# Altium schematic sheet 02 Mobile Power.SchDoc: ECE453 PWR
size B; Author: JSK; Revision: A; SheetNumber: 2; SheetTotal: 2; AssemblyNumber: ECE453-01; CurrentDate: 1/09/2018
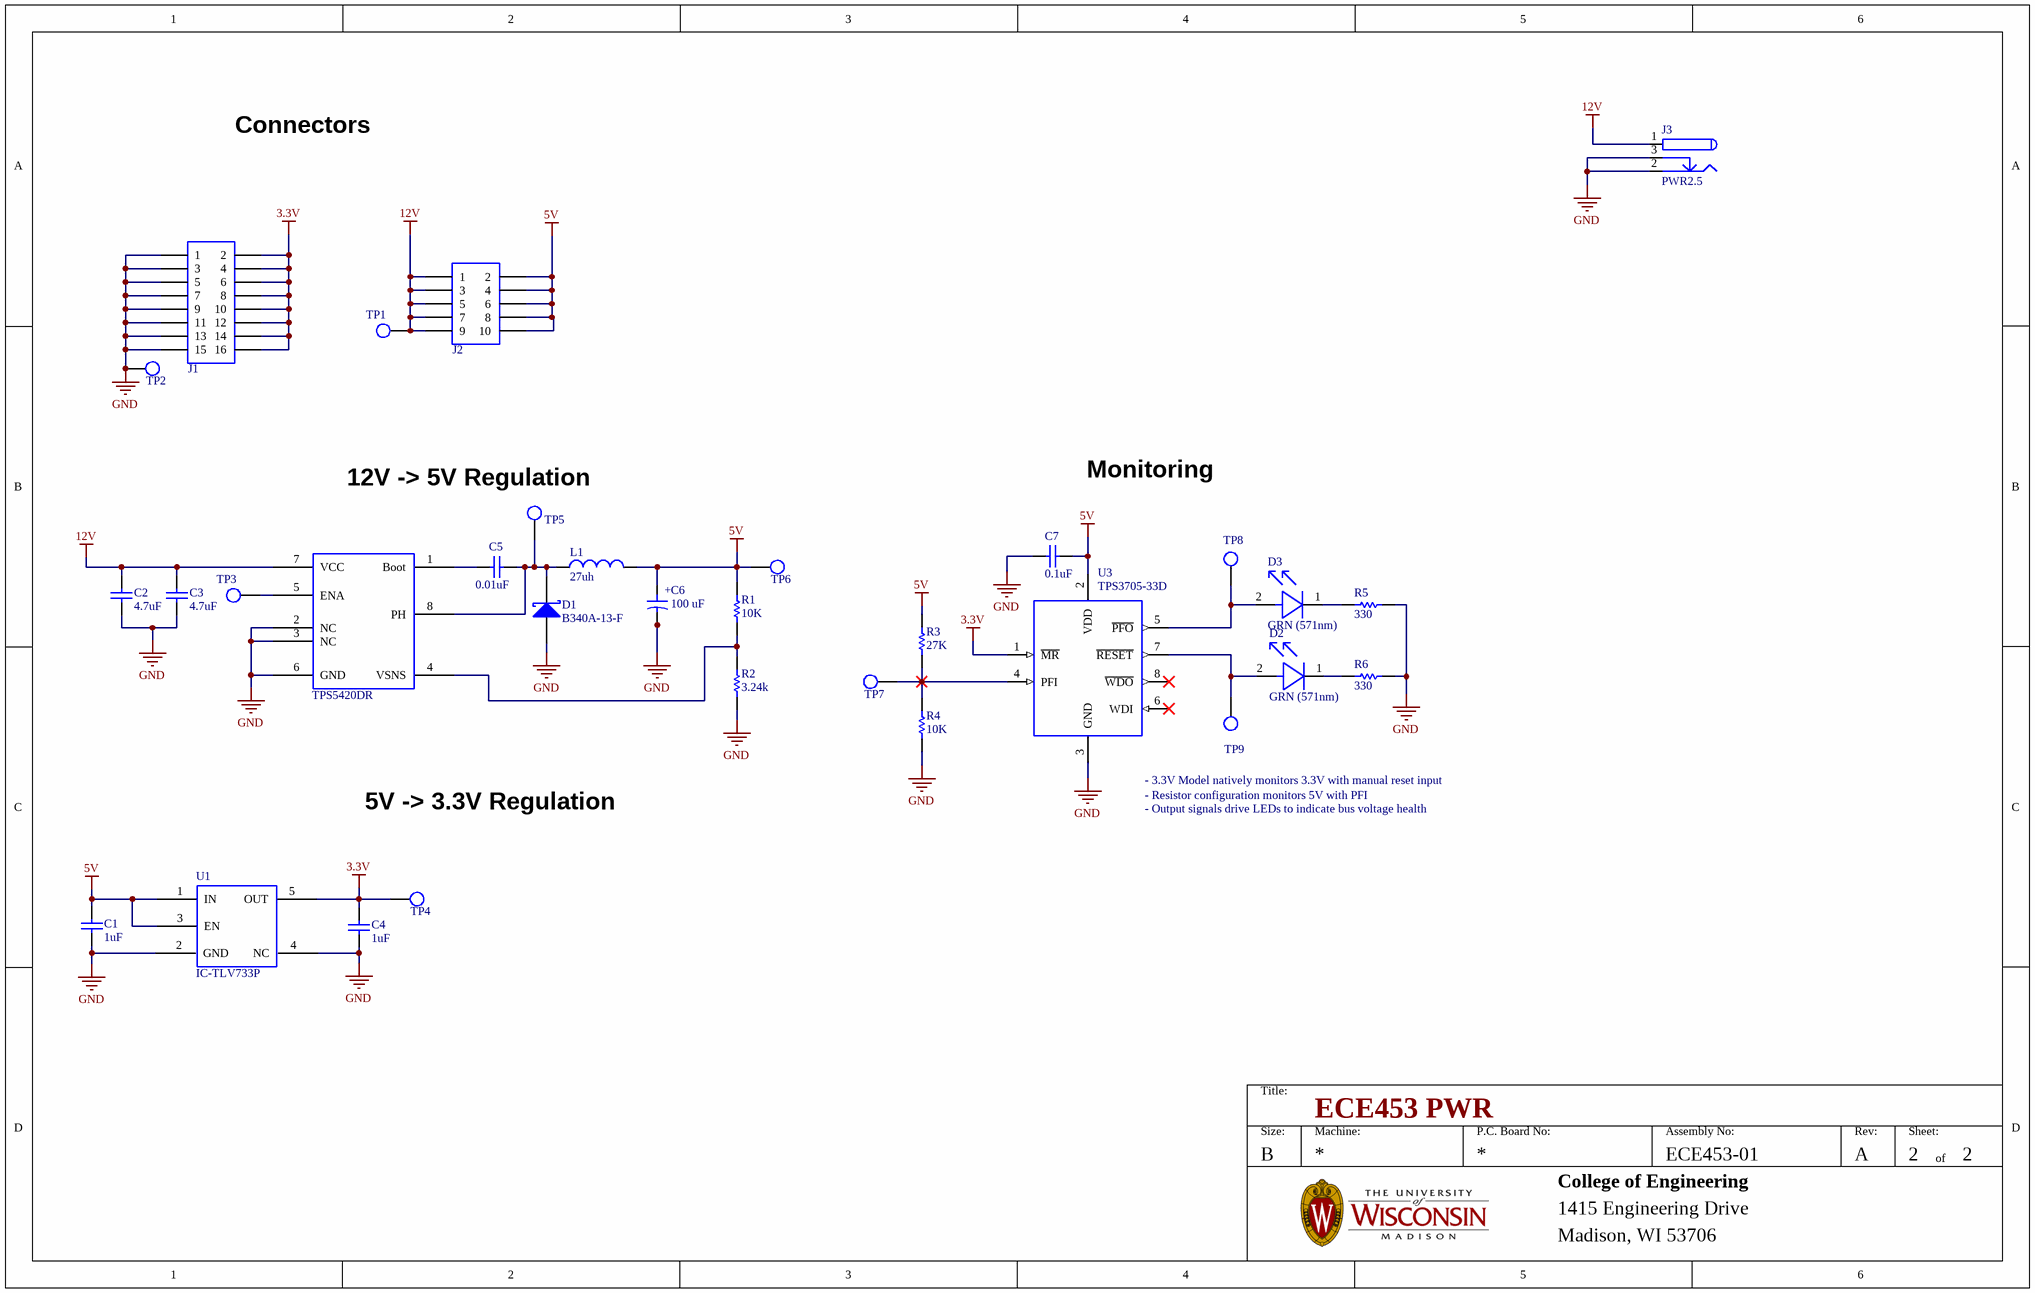
[diagram p0: 02 Mobile Power.SchDoc]

## Parts
C1  1uF  [CAP_0805]
C2  4.7uF  [CAP_0805]
C3  4.7uF  [CAP_0805]
C4  1uF  [CAP_0805]
C5  0.01uF  [CAP_0805]
C6  100 uF  [CAP_100uF]
C7  0.1uF  [CAP_0805]
D1  Manufacturer Part Number: B340A-13-F  [B340A]  (hidden comment: DIODE_B340A)
D2  value GRN (571nm)  [DIODE_0805]  (hidden comment: LED_GREEN_0805.1)
D3  value GRN (571nm)  [DIODE_0805]  (hidden comment: LED_GREEN_0805.1)
J1  CONN_HEADER_MALE_8x2  [SBH11-PBPC-D08-ST-BK]  (value not drawn)
J2  CONN_HEADER_MALE_5x2  [SBH11-PBPC-D05-ST-BK]  (value not drawn)
J3  PWR2.5  [PJ-102]
L1  Inductance: 27uh  [IND-ASPI-8040S]  (hidden comment: IND_8040S_270M)
R1  10K  [RES_0805]
R2  Resistance: 3.24k  [RES_0805]  (hidden comment: RES_0805_K_003.34)
R3  27K  [RES_0805]
R4  10K  [RES_0805]
R5  330  [RES_0805]
R6  330  [RES_0805]
TP1  TP_1206  [TP-SMC-1206]  (value not drawn)
TP2  TP_1206  [TP-SMC-1206]  (value not drawn)
TP3  TP_1206  [TP-SMC-1206]  (value not drawn)
TP4  TP_1206  [TP-SMC-1206]  (value not drawn)
TP5  TP_1206  [TP-SMC-1206]  (value not drawn)
TP6  TP_1206  [TP-SMC-1206]  (value not drawn)
TP7  TP_1206  [TP-SMC-1206]  (value not drawn)
TP8  TP_1206  [TP-SMC-1206]  (value not drawn)
TP9  TP_1206  [TP-SMC-1206]  (value not drawn)
U1  IC-TLV733P  [TI-SOT-23-5]
U2  Manufacturer Part Number: TPS5420DR  [TI-SOIC-8]  (hidden comment: IC_TPS5420)
U3  Manufacturer Part Number: TPS3705-33D  [TI-SOIC-8]  (hidden comment: IC_TPS3705-33DGN.1)

## Nets
3.3V: C4.2 J1.2 J1.4 J1.6 J1.8 J1.10 J1.12 J1.14 J1.16 TP4.1 U1.5(OUT) U3.1(~{MR})
5V: C1.2 C6.1 C7.2 J2.2 J2.4 J2.6 J2.8 J2.10 L1.2 R1.2 R3.2 TP6.1 U1.1(IN) U1.3(EN) U3.2(VDD)
12V: C2.2 C3.2 J2.1 J2.3 J2.5 J2.7 J2.9 J3.1 TP1.1 U2.7(VCC)
GND: C1.1 C2.1 C3.1 C4.1 C6.2 C7.1 D1.1(A) J1.1 J1.3 J1.5 J1.7 J1.9 J1.11 J1.13 J1.15 J3.2 J3.3 R2.1 R4.1 R5.2 R6.2 TP2.1 U1.2(GND) U1.4(NC) U2.2(NC) U2.3(NC) U2.6(GND) U3.3(GND)
NetC5_1: C5.1 U2.1(Boot)
NetC5_2: C5.2 D1.2(K) L1.1 TP5.1 U2.8(PH)
NetD2_1: D2.1(Cathode) R6.1
NetD2_2: D2.2(Anode) TP9.1 U3.7(~{RESET})
NetD3_1: D3.1(Cathode) R5.1
NetD3_2: D3.2(Anode) TP8.1 U3.5(~{PFO})
NetR1_1: R1.1 R2.2 U2.4(VSNS)
NetR3_1: R3.1 R4.2 TP7.1 U3.4(PFI)
NetTP3_1: TP3.1 U2.5(ENA)

Not connected (* = marked no-connect by the designer): U3 6(WDI)* 8(~{WDO})*

## Notes on the sheet
- Connectors
- 12V -> 5V Regulation
- Monitoring
- 5V -> 3.3V Regulation
- - 3.3V Model natively monitors 3.3V with manual reset input
- - Resistor configuration monitors 5V with PFI
- - Output signals drive LEDs to indicate bus voltage health
- Title:
- Size:
- B
- Machine:
- P.C. Board No:
- Assembly No:
- Rev:
- Sheet:
- of
- College of Engineering
- 1415 Engineering Drive
- Madison, WI 53706
- (in symbol CAP_100uF) +

## Library data of the parts
C1 C4 = CAP_0805_U_001.00: CAP CER 1 UF 6.3V 10% X5R 0805; Tolerance: +/-10%; Value: 10UF; Package: 0805; Rating: 6.3V; Supplier 1: Digi-Key; Supplier Part Number 1: 399-9160-1-ND
C2 C3 = CAP_0805_U_004.70: CAP CER 4.7 UF 16V 10% X5R 0805; Tolerance: +/-10%; Package: 0805; Rating: 16V; Value: 4.7UF; Supplier 1: Digi-Key; Supplier Part Number 1: 478-5166-6-ND
C5 = CAP_0805_U_000.01: CAP CER 10000PF 16V 10% X7R 0805; Tolerance: +/-10%; Package: 0805; Rating: 16V; Supplier 1: Digi-Key; Supplier Part Number 1: 399-7995-1-ND; Value: 10000PF
C6 = CAP_100uF: Manufacturer: Nichicon; Manufacturer Part Number: UCD1V101MNL1GS; Capacitance: 100µF; Tolerance: ±20%; Voltage Rating: 35V; Lifetime @ Temp.: 5000 Hrs @ 105°C; Ripple Current: 600mA; Impedance: 160 mOhm; Surface Mount Land Size: 0.327" L x 0.327" W (8.30mm x 8.30mm); Supplier 1: Digi-Key; RoHS: RoHS Compliant; Category: Capacitors; Stock 1: 2915; Pricing 1: 1=0.57, 10=0.548, 25=0.3884, 50=0.3272, 100=0.2659, 250=0.22088 (USD); Packaging: Cut Tape (CT); ESR (Equivalent Series Resistance): -; Operating Temperature: -55°C ~ 105°C; Type: -; Applications: General Purpose; Lead Spacing: -; Size / Dimension: 0.315" Dia (8.00mm); Height - Seated (Max): 0.413" (10.50mm); Mounting Type: Surface Mount; Package / Case: Radial, Can - SMD; ComponentLink1URL: http://nichicon-us.com/english/products/pdfs/e-cd.pdf; ComponentLink1Description: http://nichicon-us.com/english/products/pdfs/e-cd.pdf; Supplier Part Number 1: 493-6186-1-ND
C7 = CAP_0805_U_000.10: CAP CER 0.1 UF 6.3V 10% X7R 0805; Tolerance: +/-10%; Value: 1UF; Package: 0805; Rating: 6.3V; Supplier 1: Digi-Key; Supplier Part Number 1: 399-9155-6-ND
D1 = DIODE_B340A: DIODE SCHOTTKY 40V 3A SMA; Manufacturer: Diodes; Element Configuration: Single; Peak Reverse Current: 500uA; Forward Voltage: 500mV; Max Forward Surge Current (Ifsm): 80A; Polarity: Standard; Capacitance: 250pF; ComponentLink1URL: http://www.mccsemi.com/up_pdf/MBRX120-MBRX160(SOD123).pdf; ComponentLink1Description: http://www.mccsemi.com/up_pdf/MBRX120-MBRX160(SOD123).pdf; Supplier 1: Digi-Key; Stock 1: 590182; Pricing 1: 1=0.46, 10=0.373, 100=0.2538, 500=0.19034, 1000=0.14276 (USD); Mount: Surface Mount; Case/Package: SMA; Number of Pins: 2; Weight: 0.002258oz; Contact Plating: Tin,Matte; Min Operating Temperature: -55°C; Max Operating Temperature: 125°C; Forward Current: 3A; Max Repetitive Reverse Voltage (Vrrm): 40V; Packaging: Tape and Reel; Peak Non-Repetitive Surge Current: 80A; Package Quantity: 5000; Average Rectified Current: 3A; Termination: SMD/SMT; Voltage Rating (DC): 40V; Current Rating: 3A; Output Current: 3A; Current: 3A; Voltage: 40V; Max Reverse Voltage (DC): 40V; Length: 4.6mm; Height: 2.3mm; Width: 2.92mm; Radiation Hardening: No; REACH SVHC: No SVHC; Lead Free: Lead Free; ComponentLink2URL: https://datasheet.ciiva.com/4245/861ds30891-4245763.pdf; ComponentLink2Description: https://datasheet.ciiva.com/4245/861ds30891-4245763.pdf; ComponentLink3URL: https://datasheet.ciiva.com/1177/ds30891-1177476.pdf; ComponentLink3Description: https://datasheet.ciiva.com/1177/ds30891-1177476.pdf; ComponentLink4URL: https://datasheet.ciiva.com/1240/ds30891-1240228.pdf; ComponentLink4Description: https://datasheet.ciiva.com/1240/ds30891-1240228.pdf; ComponentLink5URL: https://datasheet.ciiva.com/913/ds30891-913637.pdf; ComponentLink5Description: https://datasheet.ciiva.com/913/ds30891-913637.pdf; ComponentLink6URL: https://datasheet.ciiva.com/913/ds30891-913638.pdf; ComponentLink6Description: https://datasheet.ciiva.com/913/ds30891-913638.pdf; ComponentLink7URL: https://datasheet.ciiva.com/913/ds30891-913639.pdf; ComponentLink7Description: https://datasheet.ciiva.com/913/ds30891-913639.pdf; ComponentLink8URL: https://datasheet.ciiva.com/26949/getdatasheetpartid-143394-26949352.pdf; ComponentLink8Description: https://datasheet.ciiva.com/26949/getdatasheetpartid-143394-26949352.pdf; ComponentLink9URL: https://datasheet.ciiva.com/46393/1911813-46393773.pdf; ComponentLink9Description: https://datasheet.ciiva.com/46393/1911813-46393773.pdf; Supplier Part Number 1: B340A-FDICT-ND
D2 D3 = LED_GREEN_0805.1: LED GREEN CLEAR THIN 0805 SMD; Rating: 20mA; Package: 0805; Tolerance: N/A; Supplier 1: Digi-Key; Supplier Part Number 1: 160-1426-1-ND
J1 = CONN_HEADER_MALE_8x2: CONN HEADER 2.54MM 16POS GOLD; Manufacturer: Sullins Connector Solutions; Pitch: 0.100" (2.54mm); Number of Positions Loaded: All; Number of Positions: 16; Connector Type: Header, Shrouded; Contact Finish Thickness: Flash; Contact Mating Length: -; Fastening Type: -; Contact Finish: Gold; Packaging: Tray; Row Spacing: 0.100" (2.54mm); RoHS: RoHS Compliant; Contact Type: Male Pin; Category: Connectors, Interconnects; Part Status: Active; Features: Polarizing Key; Color: Black; Mounting Type: Through Hole; Termination: Solder; Manufacturer Part Number: SBH11-PBPC-D08-ST-BK; Number of Rows: 2; Supplier 1: Digi-Key; Stock 1: 13784; Pricing 1: 1=0.55, 10=0.428, 25=0.3988, 50=0.3626, 100=0.3263, 250=0.27552, 500=0.261, 1000=0.232, 2500=0.19285 (USD); ComponentLink1URL: http://sullinscorp.com/catalogs/145_PAGE118_.100_SBH11_SERIES_MALE_BOX_HDR_ST_RA_SMT.pdf; ComponentLink1Description: http://sullinscorp.com/catalogs/145_PAGE118_.100_SBH11_SERIES_MALE_BOX_HDR_ST_RA_SMT.pdf; Supplier Part Number 1: S9171-ND
J2 = CONN_HEADER_MALE_5x2: CONN HEADER 2.54MM 10POS GOLD; Manufacturer: Sullins Connector Solutions; Pitch: 0.100" (2.54mm); Number of Positions: 10; Number of Positions Loaded: All; Connector Type: Header, Shrouded; Contact Mating Length: -; Fastening Type: -; Termination: Solder; Mounting Type: Through Hole; Color: Black; Contact Finish Thickness: Flash; Row Spacing: 0.100" (2.54mm); Contact Finish: Gold; Number of Rows: 2; Features: Polarizing Key; Contact Type: Male Pin; Manufacturer Part Number: SBH11-PBPC-D05-ST-BK; Category: Connectors, Interconnects; Packaging: Tray; Part Status: Active; RoHS: RoHS Compliant; Supplier 1: Digi-Key; Stock 1: 29227; Pricing 1: 1=0.64, 10=0.445, 25=0.3812, 50=0.343, 100=0.2985, 250=0.254, 500=0.2413, 1000=0.2159, 2500=0.17145 (USD); ComponentLink1URL: http://sullinscorp.com/catalogs/145_PAGE118_.100_SBH11_SERIES_MALE_BOX_HDR_ST_RA_SMT.pdf; ComponentLink1Description: http://sullinscorp.com/catalogs/145_PAGE118_.100_SBH11_SERIES_MALE_BOX_HDR_ST_RA_SMT.pdf; Supplier Part Number 1: S9169-ND
J3 = PWR2.5: Low Voltage Power Supply Connector; Manufacturer: CUI; Manufacturer Part Number: PJ-102A; Gender: Male; Shielding: Unshielded; Current Rating: 2.5A; Connector Type: Jack; Voltage Rating: 24V; Insulation Resistance: 50MR; Number of Conductors: 2; Published: 17-Dec-2003; DatasheetDocument: 09-May-2002; Publisher: Altium Limited; ComponentLink1Description: Manufacturer Link; ComponentLink1URL: http://domino.kycon.com/internet/Products.html; Supplier 1: Digi-Key; Stock 1: 20997; Pricing 1: 1=0.64, 10=0.6, 25=0.54, 50=0.48, 100=0.46, 250=0.42, 500=0.4, 1000=0.33, 2500=0.3 (USD); Mount: Through Hole; Colour: Black; Contact Material: Copper; Contact Plating: Nickel; Housing Colour: Black; Housing Material: Thermoplastic; Min Operating Temperature: -25°C; Max Operating Temperature: 85°C; Package Quantity: 280; Termination: Through Hole; Contact Gender: Male; Orientation: Horizontal; Packaging: Bulk; Diameter: 2.1mm; Lead Free: Lead Free; Flammability Rating: UL94 V-0; ComponentLink2URL: http://www.cui.com/Product/Resource/FuturePDF/PJ-102A.pdf; ComponentLink2Description: http://www.cui.com/Product/Resource/FuturePDF/PJ-102A.pdf; ComponentLink3URL: http://www.mouser.com/ds/2/670/PJ-102A-524195.pdf; ComponentLink3Description: http://www.mouser.com/ds/2/670/PJ-102A-524195.pdf; ComponentLink4URL: https://www.cui.com/product/resource/digikeypdf/pj-102a.pdf; ComponentLink4Description: https://www.cui.com/product/resource/digikeypdf/pj-102a.pdf; Supplier Part Number 1: CP-102A-ND
L1 = IND_8040S_270M: Manufacturer: Abracon; Manufacturer Part Number: ASPI-8040S-270M-T; Core Material: Ferrite; Tolerance: 20%; Current Rating: 2A; Shielding: Shielded; DC Resistance (DCR): 78mR; Test Frequency: 100kHz; Saturation Current: 2.15A; Self Resonant Frequency: 9.2MHz; ComponentLink1URL: http://www.abracon.com/Magnetics/chips/AIML-1206.pdf; ComponentLink1Description: http://www.abracon.com/Magnetics/chips/AIML-1206.pdf; Supplier 1: Digi-Key; Stock 1: 2115; Pricing 1: 1=0.97, 10=0.897, 100=0.6486, 500=0.4968 (USD); Mount: Surface Mount; Case/Package: Nonstandard; Min Operating Temperature: -40°C; Max Operating Temperature: 125°C; Packaging: Tape and Reel; Composition: Wirewound; Max DC Current: 2A; Package Quantity: 1000; Length: 0.315inch; Height: 4mm; Width: 0.315inch; Height - Seated (Max): 0.157inch; Lead Free: Lead Free; ComponentLink2URL: https://datasheet.ciiva.com/8518/aspi-8040s-8518746.pdf; ComponentLink2Description: https://datasheet.ciiva.com/8518/aspi-8040s-8518746.pdf; ComponentLink3URL: https://datasheet.ciiva.com/1080/aspi-8040s-1080475.pdf; ComponentLink3Description: https://datasheet.ciiva.com/1080/aspi-8040s-1080475.pdf; ComponentLink4URL: https://datasheet.ciiva.com/1080/aspi-8040s-1080476.pdf; ComponentLink4Description: https://datasheet.ciiva.com/1080/aspi-8040s-1080476.pdf; Supplier Part Number 1: ASPI-8040S-270M-TCT-ND
R1 R4 = RES_0805_K_010.00: RES SMD 10K OHM 1% 1/8W 0805; Manufacturer Part Number: ERJ-6ENF1002V; Manufacturer: Panasonic Electronic Components; Power (Watts): 0.125W, 1/8W; Temperature Coefficient: ±100ppm/°C; Part Status: Active; Supplier Device Package: 0805; Category: Resistors; Tolerance: ±1%; Package / Case: 0805 (2012 Metric); Number of Terminations: 2; RoHS: RoHS Compliant; Supplier: Digi-Key; Size / Dimension: 0.079" L x 0.049" W (2.00mm x 1.25mm); Failure Rate: -; Resistance (Ohms): 10k; Composition: Thick Film; Packaging: Cut Tape (CT); Features: Automotive AEC-Q200; Height - Seated (Max): 0.028" (0.70mm); Operating Temperature: -55°C ~ 155°C; Supplier Part Number: P10.0KCCT-ND
R2 = RES_0805_K_003.34: RES SMD 3.24K OHM 1% 1/8W 0805; Manufacturer: Panasonic; Manufacturer Part Number: ERJ-6ENF3241V; Power Rating: 125mW; Voltage Rating: 150V; Temperature Coefficient: 100ppm/°C; Supplier 1: Digi-Key; Stock 1: 232903; Pricing 1: 1=0.1, 10=0.079, 100=0.0305, 1000=0.0134, 2500=0.01157 (USD); Mount: Surface Mount; Case/Package: 0805; Case Code (Metric): 2012; Case Code (Imperial): 0805; Contact Plating: Tin; Min Operating Temperature: -55°C; Max Operating Temperature: 155°C; Tolerance: 1%; Packaging: Tape and Reel; Package Quantity: 1; Composition: Thick Film; Voltage Rating (DC): 150V; Termination: SMD/SMT; Military Standard: Not; Number of Terminations: 2; Max Power Dissipation: 125mW; Length: 2mm; Height: 0.6mm; Width: 0.049inch; Depth: 1.25mm; Radiation Hardening: No; REACH SVHC: No SVHC; Lead Free: Lead Free; ComponentLink1URL: https://datasheet.ciiva.com/9196/aoa0000ce2-9196535.pdf; ComponentLink1Description: https://datasheet.ciiva.com/9196/aoa0000ce2-9196535.pdf; ComponentLink2URL: https://datasheet.ciiva.com/30112/aoa0000ce2-30112759.pdf; ComponentLink2Description: https://datasheet.ciiva.com/30112/aoa0000ce2-30112759.pdf; ComponentLink3URL: https://datasheet.ciiva.com/28531/1694929-28531704.pdf; ComponentLink3Description: https://datasheet.ciiva.com/28531/1694929-28531704.pdf; ComponentLink4URL: https://datasheet.ciiva.com/46372/1678782-46372873.pdf; ComponentLink4Description: https://datasheet.ciiva.com/46372/1678782-46372873.pdf; ComponentLink5URL: https://datasheet.ciiva.com/17213/aoa0000ce2-17213770.pdf; ComponentLink5Description: https://datasheet.ciiva.com/17213/aoa0000ce2-17213770.pdf; ComponentLink6URL: https://datasheet.ciiva.com/46372/1678782-46372874.pdf; ComponentLink6Description: https://datasheet.ciiva.com/46372/1678782-46372874.pdf; ComponentLink7URL: https://datasheet.ciiva.com/24026/aoa0000ce2-24026155.pdf; ComponentLink7Description: https://datasheet.ciiva.com/24026/aoa0000ce2-24026155.pdf; ComponentLink8URL: https://datasheet.ciiva.com/22668/1678782-22668189.pdf; ComponentLink8Description: https://datasheet.ciiva.com/22668/1678782-22668189.pdf; Supplier Part Number 1: P3.24KCCT-ND
R3 = RES_0805_K_027.00: RES SMD 27.0K OHM 1% 1/8W 0805; Manufacturer Part Number: ERJ-6ENF2802V; Manufacturer: Panasonic Electronic Components; Power (Watts): 0.125W, 1/8W; Resistance (Ohms): 28k; Temperature Coefficient: ±100ppm/°C; Number of Terminations: 2; Package / Case: 0805 (2012 Metric); Operating Temperature: -55°C ~ 155°C; Features: Automotive AEC-Q200; Failure Rate: -; Packaging: Cut Tape (CT); Size / Dimension: 0.079" L x 0.049" W (2.00mm x 1.25mm); Composition: Thick Film; Supplier Device Package: 0805; Part Status: Active; Height - Seated (Max): 0.028" (0.70mm); Tolerance: ±1%; Supplier: Digi-Key; RoHS: RoHS Compliant; Category: Resistors; Supplier Part Number: P28.0KCCT-ND; Supplier 1: Digi-Key; Supplier Part Number 1: CR0805-FX-2702GLFDKR-ND
R5 R6 = RES_0805_R_330.00: RES SMD 330 OHM 1% 1/8W 0805; Manufacturer: Panasonic Electronic Components; Manufacturer Part Number: ERJ-6GEYJ331V; Temperature Coefficient: ±200ppm/°C; Tolerance: ±5%; Power (Watts): 0.125W, 1/8W; Resistance (Ohms): 330; Features: Automotive AEC-Q200; Number of Terminations: 2; Composition: Thick Film; RoHS: RoHS Compliant; Part Status: Active; Packaging: Cut Tape (CT); Package / Case: 0805 (2012 Metric); Size / Dimension: 0.079" L x 0.049" W (2.00mm x 1.25mm); Operating Temperature: -55°C ~ 155°C; Height - Seated (Max): 0.028" (0.70mm); Supplier Device Package: 0805; Failure Rate: -; Supplier: Digi-Key; Category: Resistors; Supplier Part Number: P330ACT-ND
TP1-TP9 = TP_1206: Test Point SMD 1206; Supplier 1: Digi-Key; Supplier Part Number 1: A106143CT-ND
U1 = IC-TLV733P: IC REG LINEAR 3.3V 300MA SOT23-5
U2 = IC_TPS5420: IC REG BUCK ADJ 2A 8SOIC; Manufacturer: Texas Instruments; Output Voltage: 31V; Number of Outputs: 1; Switching Frequency: 500kHz; Max Input Voltage: 36V; Min Input Voltage: 5.5V; Synchronous Rectifier: No; Min Output Voltage: 1.23V; Quiescent Current: 3mA; Efficiency: 95%; Supplier 1: Digi-Key; Stock 1: 17036; Pricing 1: 1=3.24, 10=2.912, 100=2.3861, 500=2.03124, 1000=1.7131 (USD); Case/Package: D; Number of Pins: 8; Weight: 0.002677oz; Min Operating Temperature: -40°C; Max Operating Temperature: 125°C; Packaging: Tape and Reel; Package Quantity: 2500; Output Current: 2A; Max Output Current: 2A; Max Output Voltage: 31V; Operating Supply Voltage: 36V; Radiation Hardening: No; Lead Free: Lead Free; ComponentLink1URL: https://datasheet.ciiva.com/6596/tps5420-6596997.pdf; ComponentLink1Description: https://datasheet.ciiva.com/6596/tps5420-6596997.pdf; ComponentLink2URL: https://datasheet.ciiva.com/6596/tps5420-6596998.pdf; ComponentLink2Description: https://datasheet.ciiva.com/6596/tps5420-6596998.pdf; ComponentLink3URL: https://datasheet.ciiva.com/34302/1523971-34302343.pdf; ComponentLink3Description: https://datasheet.ciiva.com/34302/1523971-34302343.pdf; ComponentLink4URL: https://datasheet.ciiva.com/3220/tps5420-3220184.pdf; ComponentLink4Description: https://datasheet.ciiva.com/3220/tps5420-3220184.pdf; ComponentLink5URL: https://datasheet.ciiva.com/6580/tps5420-6580024.pdf; ComponentLink5Description: https://datasheet.ciiva.com/6580/tps5420-6580024.pdf; ComponentLink6URL: https://datasheet.ciiva.com/3220/tps5420-3220185.pdf; ComponentLink6Description: https://datasheet.ciiva.com/3220/tps5420-3220185.pdf; Supplier Part Number 1: 296-31984-1-ND
U3 = IC_TPS3705-33DGN.1: IC 2.93V PROCESSOR MONITOR 8MSOP; Manufacturer: Texas Instruments; Number of Voltages Monitored: 1; Output: Push-Pull, Totem Pole; Reset: Active Low; Reset Timeout: 140 ms Minimum; Supplier 1: Digi-Key; RoHS: RoHS Compliant; Category: Integrated Circuits (ICs); Stock 1: 1844; Pricing 1: 1=2.04, 10=1.831, 100=1.4718, 500=1.20926, 1000=1.00195, 2500=0.93285, 5000=0.8983, 10000=0.86375 (USD); Packaging: Tube; Part Status: Active; Type: Simple Reset/Power-On Reset; Voltage - Threshold: 2.93V; Operating Temperature: -40°C ~ 85°C (TA); Mounting Type: Surface Mount; Package / Case: 8-SOIC (0.154", 3.90mm Width); Supplier Device Package: 8-SOIC; ComponentLink1URL: http://www.ti.com/lit/ds/symlink/tps3705-30.pdf; ComponentLink1Description: http://www.ti.com/lit/ds/symlink/tps3705-30.pdf; Supplier Part Number 1: 296-2623-5-ND